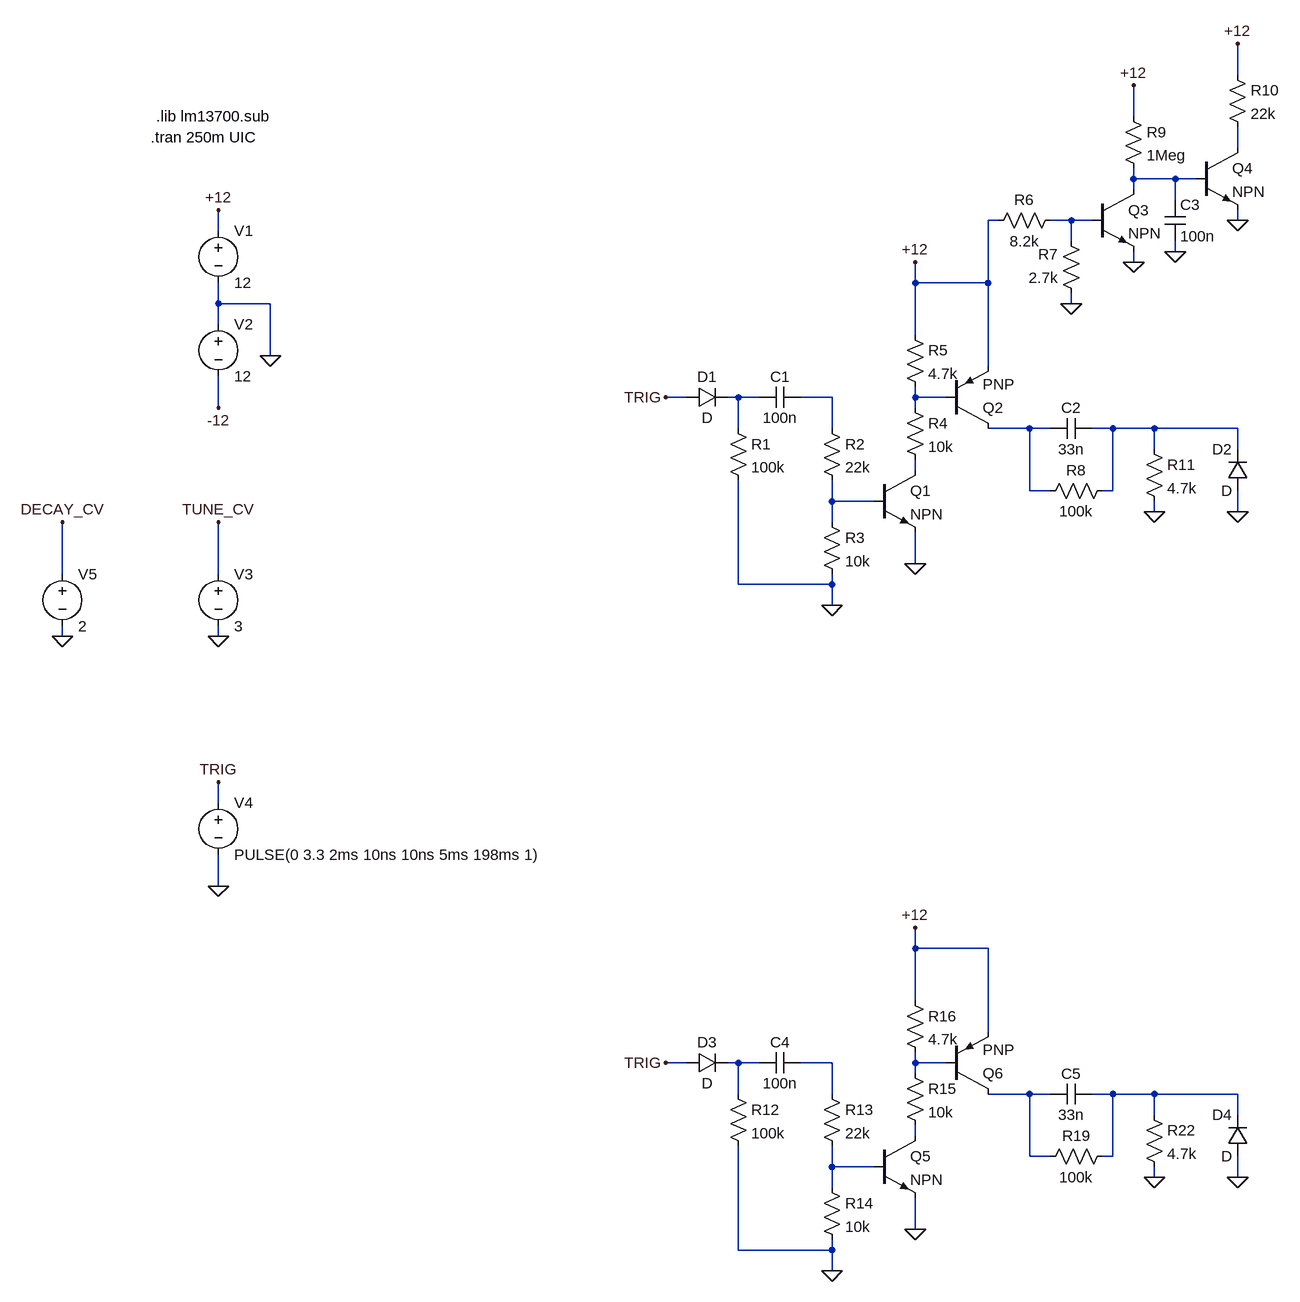
[diagram p0: schematic KickEnvSim.asc]
KickEnvSim.asc, the LTspice schematic file:
Version 4
SHEET 1 4072 3692
WIRE 1632 16 1632 -32
WIRE 1472 80 1472 32
WIRE 1632 128 1632 96
WIRE 1472 176 1472 160
WIRE 1536 176 1472 176
WIRE 1568 176 1536 176
WIRE 1472 192 1472 176
WIRE 1536 208 1536 176
WIRE 1264 240 1248 240
WIRE 1376 240 1344 240
WIRE 1408 240 1376 240
WIRE 1632 240 1632 224
WIRE 64 256 64 224
WIRE 1376 272 1376 240
WIRE 1536 288 1536 272
WIRE 1472 304 1472 288
WIRE 1136 336 1136 304
WIRE 1248 336 1248 240
WIRE 1248 336 1136 336
WIRE 64 368 64 336
WIRE 144 368 64 368
WIRE 1376 368 1376 352
WIRE 64 400 64 368
WIRE 1136 416 1136 336
WIRE 144 448 144 368
WIRE 1248 464 1248 336
WIRE 784 512 752 512
WIRE 864 512 848 512
WIRE 896 512 864 512
WIRE 1008 512 960 512
WIRE 1136 512 1136 496
WIRE 1184 512 1136 512
WIRE 64 528 64 480
WIRE 1136 528 1136 512
WIRE 864 560 864 512
WIRE 1008 560 1008 512
WIRE 1312 560 1248 560
WIRE 1344 560 1312 560
WIRE 1440 560 1408 560
WIRE 1504 560 1440 560
WIRE 1632 560 1504 560
WIRE 1504 592 1504 560
WIRE 1632 592 1632 560
WIRE 1136 624 1136 608
WIRE 1312 656 1312 560
WIRE 1344 656 1312 656
WIRE 1440 656 1440 560
WIRE 1440 656 1424 656
WIRE 1008 672 1008 640
WIRE 1072 672 1008 672
WIRE 1504 688 1504 672
WIRE 1632 688 1632 656
WIRE 1008 704 1008 672
WIRE 1136 768 1136 720
WIRE -176 784 -176 704
WIRE 64 784 64 704
WIRE 864 800 864 640
WIRE 1008 800 1008 784
WIRE 1008 800 864 800
WIRE 1008 832 1008 800
WIRE -176 880 -176 864
WIRE 64 880 64 864
WIRE 64 1136 64 1104
WIRE 64 1264 64 1216
WIRE 1136 1360 1136 1328
WIRE 1248 1360 1136 1360
WIRE 1136 1440 1136 1360
WIRE 1248 1488 1248 1360
WIRE 784 1536 752 1536
WIRE 864 1536 848 1536
WIRE 896 1536 864 1536
WIRE 1008 1536 960 1536
WIRE 1136 1536 1136 1520
WIRE 1184 1536 1136 1536
WIRE 1136 1552 1136 1536
WIRE 864 1584 864 1536
WIRE 1008 1584 1008 1536
WIRE 1312 1584 1248 1584
WIRE 1344 1584 1312 1584
WIRE 1440 1584 1408 1584
WIRE 1504 1584 1440 1584
WIRE 1632 1584 1504 1584
WIRE 1504 1616 1504 1584
WIRE 1632 1616 1632 1584
WIRE 1136 1648 1136 1632
WIRE 1312 1680 1312 1584
WIRE 1344 1680 1312 1680
WIRE 1440 1680 1440 1584
WIRE 1440 1680 1424 1680
WIRE 1008 1696 1008 1664
WIRE 1072 1696 1008 1696
WIRE 1504 1712 1504 1696
WIRE 1632 1712 1632 1680
WIRE 1008 1728 1008 1696
WIRE 1136 1792 1136 1744
WIRE 864 1824 864 1664
WIRE 1008 1824 1008 1808
WIRE 1008 1824 864 1824
WIRE 1008 1856 1008 1824
FLAG 64 224 +12
FLAG 64 528 -12
FLAG 144 448 0
FLAG 64 880 0
FLAG 64 704 TUNE_CV
FLAG 64 1104 TRIG
FLAG 64 1264 0
FLAG 752 512 TRIG
FLAG 1008 832 0
FLAG 1136 768 0
FLAG 1136 304 +12
FLAG 1376 368 0
FLAG 1472 304 0
FLAG 1472 32 +12
FLAG 1632 240 0
FLAG 1632 -32 +12
FLAG 1536 288 0
FLAG 1504 688 0
FLAG 1632 688 0
FLAG -176 880 0
FLAG -176 704 DECAY_CV
FLAG 752 1536 TRIG
FLAG 1008 1856 0
FLAG 1136 1792 0
FLAG 1136 1328 +12
FLAG 1504 1712 0
FLAG 1632 1712 0
SYMBOL voltage 64 240 R0
SYMATTR InstName V1
SYMATTR Value 12
SYMBOL voltage 64 384 R0
SYMATTR InstName V2
SYMATTR Value 12
SYMBOL voltage 64 768 R0
SYMATTR InstName V3
SYMATTR Value 3
SYMBOL voltage 64 1120 R0
SYMATTR InstName V4
SYMATTR Value PULSE(0 3.3 2ms 10ns 10ns 5ms 198ms 1)
SYMBOL diode 784 528 R270
WINDOW 0 32 32 VTop 2
WINDOW 3 0 32 VBottom 2
SYMATTR InstName D1
SYMBOL res 848 544 R0
SYMATTR InstName R1
SYMATTR Value 100k
SYMBOL res 992 544 R0
SYMATTR InstName R2
SYMATTR Value 22k
SYMBOL res 992 688 R0
SYMATTR InstName R3
SYMATTR Value 10k
SYMBOL cap 960 496 R90
WINDOW 0 0 32 VBottom 2
WINDOW 3 32 32 VTop 2
SYMATTR InstName C1
SYMATTR Value 100n
SYMBOL npn 1072 624 R0
SYMATTR InstName Q1
SYMBOL res 1120 512 R0
SYMATTR InstName R4
SYMATTR Value 10k
SYMBOL res 1120 400 R0
SYMATTR InstName R5
SYMATTR Value 4.7k
SYMBOL pnp 1184 560 M180
SYMATTR InstName Q2
SYMBOL cap 1408 544 R90
WINDOW 0 0 32 VBottom 2
WINDOW 3 32 32 VTop 2
SYMATTR InstName C2
SYMATTR Value 33n
SYMBOL npn 1408 192 R0
SYMATTR InstName Q3
SYMBOL res 1360 224 R90
WINDOW 0 0 56 VBottom 2
WINDOW 3 32 56 VTop 2
SYMATTR InstName R6
SYMATTR Value 8.2k
SYMBOL res 1392 368 R180
WINDOW 0 36 76 Left 2
WINDOW 3 36 40 Left 2
SYMATTR InstName R7
SYMATTR Value 2.7k
SYMBOL res 1440 640 R90
WINDOW 0 0 56 VBottom 2
WINDOW 3 32 56 VTop 2
SYMATTR InstName R8
SYMATTR Value 100k
SYMBOL res 1456 64 R0
SYMATTR InstName R9
SYMATTR Value 1Meg
SYMBOL npn 1568 128 R0
SYMATTR InstName Q4
SYMBOL res 1616 0 R0
SYMATTR InstName R10
SYMATTR Value 22k
SYMBOL cap 1520 208 R0
SYMATTR InstName C3
SYMATTR Value 100n
SYMBOL res 1488 576 R0
SYMATTR InstName R11
SYMATTR Value 4.7k
SYMBOL diode 1648 656 R180
WINDOW 0 24 64 Left 2
WINDOW 3 24 0 Left 2
SYMATTR InstName D2
SYMBOL voltage -176 768 R0
SYMATTR InstName V5
SYMATTR Value 2
SYMBOL diode 784 1552 R270
WINDOW 0 32 32 VTop 2
WINDOW 3 0 32 VBottom 2
SYMATTR InstName D3
SYMBOL res 848 1568 R0
SYMATTR InstName R12
SYMATTR Value 100k
SYMBOL res 992 1568 R0
SYMATTR InstName R13
SYMATTR Value 22k
SYMBOL res 992 1712 R0
SYMATTR InstName R14
SYMATTR Value 10k
SYMBOL cap 960 1520 R90
WINDOW 0 0 32 VBottom 2
WINDOW 3 32 32 VTop 2
SYMATTR InstName C4
SYMATTR Value 100n
SYMBOL npn 1072 1648 R0
SYMATTR InstName Q5
SYMBOL res 1120 1536 R0
SYMATTR InstName R15
SYMATTR Value 10k
SYMBOL res 1120 1424 R0
SYMATTR InstName R16
SYMATTR Value 4.7k
SYMBOL pnp 1184 1584 M180
SYMATTR InstName Q6
SYMBOL cap 1408 1568 R90
WINDOW 0 0 32 VBottom 2
WINDOW 3 32 32 VTop 2
SYMATTR InstName C5
SYMATTR Value 33n
SYMBOL res 1440 1664 R90
WINDOW 0 0 56 VBottom 2
WINDOW 3 32 56 VTop 2
SYMATTR InstName R19
SYMATTR Value 100k
SYMBOL res 1488 1600 R0
SYMATTR InstName R22
SYMATTR Value 4.7k
SYMBOL diode 1648 1680 R180
WINDOW 0 24 64 Left 2
WINDOW 3 24 0 Left 2
SYMATTR InstName D4
TEXT -40 112 Left 2 !.tran 250m UIC
TEXT -32 80 Left 2 !.lib lm13700.sub

The netlist it stands for:
* KickEnvSim.asc
V1 +12 0 12
V2 0 -12 12
V3 TUNE_CV 0 3
V4 TRIG 0 PULSE(0 3.3 2ms 10ns 10ns 5ms 198ms 1)
D1 TRIG N004 D
R1 N004 0 100k
R2 N005 N010 22k
R3 N010 0 10k
C1 N005 N004 100n
Q1 N009 N010 0 0 NPN
R4 N006 N009 10k
R5 +12 N006 4.7k
Q2 N007 N006 +12 0 PNP
C2 N008 N007 33n
Q3 N002 N003 0 0 NPN
R6 N003 +12 8.2k
R7 0 N003 2.7k
R8 N008 N007 100k
R9 +12 N002 1Meg
Q4 N001 N002 0 0 NPN
R10 +12 N001 22k
C3 N002 0 100n
R11 N008 0 4.7k
D2 0 N008 D
V5 DECAY_CV 0 2
D3 TRIG N011 D
R12 N011 0 100k
R13 N012 N017 22k
R14 N017 0 10k
C4 N012 N011 100n
Q5 N016 N017 0 0 NPN
R15 N013 N016 10k
R16 +12 N013 4.7k
Q6 N014 N013 +12 0 PNP
C5 N015 N014 33n
R19 N015 N014 100k
R22 N015 0 4.7k
D4 0 N015 D
.model D D
.lib standard.dio
.model NPN NPN
.model PNP PNP
.lib standard.bjt
.tran 250m UIC
.lib lm13700.sub
.backanno
.end